# Altium schematic sheet Sheet1.SchDoc
size A4; SheetNumber: 1; SheetTotal: 1
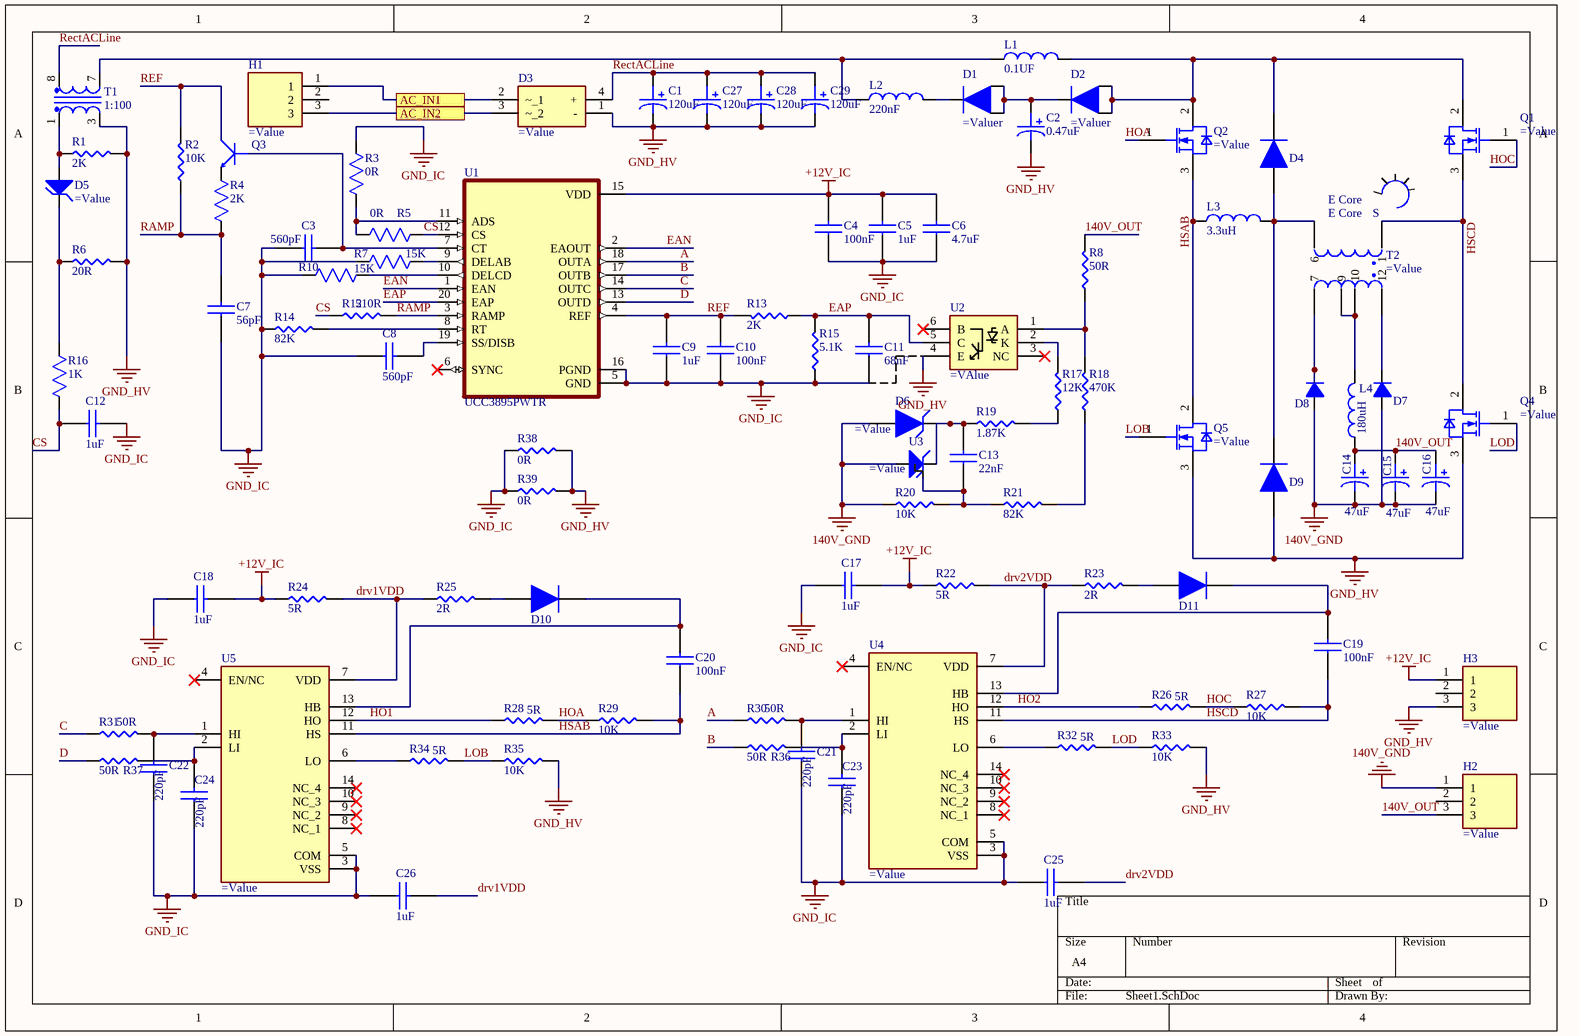
[diagram p0: Sheet1.SchDoc]

## Parts
(Parts that share a designator on the sheet are numbered #1, #2 ... from top to bottom, then left to right.)
?#1  (no value)
?#2  (no value)
C1  120uF  [18AL_CAP]
C2  0.47uF  [860021373001_PCB]
C3  560pF  [CAP_0805]
C4  100nF  [CAP_0805]
C5  1uF  [CAP_0805]
C6  4.7uF  [CAP_0805]
C7  56pF  [CAP_0805]
C8  560pF  [CAP_0805]
C9  1uF  [CAP_0805]
C10  100nF  [CAP_0805]
C11  68nF  [CAP_0805]
C12  1uF  [CAP_0805]
C13  22nF  [CAP_0805]
C14  47uF  [CAP200V47uF]
C15  47uF  [CAP200V47uF]
C16  47uF  [CAP200V47uF]
C17  1uF  [CAP_0805]
C18  1uF  [CAP_0805]
C19  100nF  [CAP_0805]
C20  100nF  [CAP_0805]
C21  220pF  [CAP_0805]
C22  220pF  [CAP_0805]
C23  220pF  [CAP_0805]
C24  220pF  [CAP_0805]
C25  1uF  [CAP_0805]
C26  1uF  [CAP_0805]
C27  120uF  [18AL_CAP]
C28  120uF  [18AL_CAP]
C29  120uF  [18AL_CAP]
D1  (no value)  [DPAK(TO-252-2)]
D2  (no value)  [DPAK(TO-252-2)]
D3  (no value)  [4-SIP]
D4  (no value)  [DO-214AB(SMC)]
D5  (no value)  [SOD123]
D6  (no value)  [DO_214AA]
D7  (no value)  [DPAK(TO-252-2)]
D8  (no value)  [DPAK(TO-252-2)]
D9  (no value)  [DO-214AB(SMC)]
D10  (no value)  [DO-214AB(SMC)]
D11  (no value)  [DO-214AB(SMC)]
H1  (no value)  [3 x 5.08 POS]
H2  (no value)  [3 x 5.08 POS]
H3  (no value)  [3 x 5.08 POS]
L1  0.1UF  [7.30mm x 6.60mm]
L2  220nF  [7.30mm x 6.60mm]
L3  3.3uH  [14.4MOHM SMD]
L4  180uH  [2300HT-181-V-RC]
Q1  (no value)  [TO220]
Q2  (no value)  [TO220]
Q3  (no value)  [SOT-23-3]
Q4  (no value)  [TO220]
Q5  (no value)  [TO220]
R1  2K  [RES_0805]
R2  10K  [RES_0805]
R3  0R  [RES_0805]
R4  2K  [RES_0805]
R5  0R  [RES_0805]
R6  20R  [RES_0805]
R7  15K  [RES_0805]
R8  50R  [RES_0805]
R10  15K  [RES_0805]
R12  510R  [RES_0805]
R13  2K  [RES_0805]
R14  82K  [RES_0805]
R15  5.1K  [RES_0805]
R16  1K  [RES_0805]
R17  12K  [RES_0805]
R18  470K  [RES_0805]
R19  1.87K  [RES_0603]
R20  10K  [RES_0805]
R21  82K  [RES_0805]
R22  5R  [RES_0805]
R23  2R  [RES_0805]
R24  5R  [RES_0805]
R25  2R  [RES_0805]
R26  5R  [RES_0805]
R27  10K  [RES_0805]
R28  5R  [RES_0805]
R29  10K  [RES_0805]
R30  50R  [RES_0805]
R31  50R  [RES_0805]
R32  5R  [RES_0805]
R33  10K  [RES_0805]
R34  5R  [RES_0805]
R35  10K  [RES_0805]
R36  50R  [RES_0805]
R37  50R  [RES_0805]
R38  0R  [RES_0805]
R39  0R  [RES_0805]
S  (no value)  [Sogutucu60x90]
T1  1:100  [PA1005.100QNLT]
T2  (no value)  [FE0270]
U1  UCC3895PWTR  [20-SOIC]
U2  (no value)  [CNY172SM_FP]
U3  (no value)  [SOT-23-3]
U4  (no value)  [14-SOP]
U5  (no value)  [14-SOP]

## Ports
AC_IN1, AC_IN2

## Nets
140V_GND: C14.2 C15.2 C16.2 D6.A D7.3 D8.3 H2.1 R20.1 U3.2
+12V_IC: C4.2 C5.2 C6.2 C17.2 C18.2 H3.1 R22.1 R24.1 U1.15(VDD)
GND_HV: C1.2 C2.2 C27.2 C28.2 C29.2 D3.1(-) D9.2 H3.3 Q4.3(SOURCE) Q5.3(SOURCE) R1.2 R6.2 R33.2 R35.2 R38.2 R39.2 T1.3 U2.4(E)
GND_IC: C3.1 C4.1 C5.1 C6.1 C7.1 C8.1 C9.1 C10.1 C11.1 C12.2 C17.1 C18.1 C21.1 C22.1 C23.1 C24.1 C25.1 C26.1 R3.2 R7.1 R10.1 R14.1 R15.1 R38.1 R39.1 U1.5(GND) U1.16(PGND) U4.3(VSS) U4.5(COM) U5.3(VSS) U5.5(COM)
140V_OUT: C14.1 C15.1 C16.1 H2.3 L4.1 R8.2
A: R30.1 U1.18(OUTA)
AC_IN1: D3.2(~_1) H1.1 ; port AC_IN1
AC_IN2: D3.3(~_2) H1.3 ; port AC_IN2
B: R36.1 U1.17(OUTB)
C: R31.1 U1.14(OUTC)
CS: C12.1 R5.2 R12.1 R16.1 U1.12(CS)
D: R37.1 U1.13(OUTD)
drv1VDD: C26.2 R24.2 R25.1 U5.7(VDD)
drv2VDD: C25.2 R22.2 R23.1 U4.7(VDD)
EAN: U1.1(EAN) U1.2(EAOUT)
EAP: C11.2 R13.1 R15.2 U1.20(EAP) U2.5(C)
HO1: R28.1 U5.12(HO)
HO2: R26.1 U4.12(HO)
HOA: Q2.1(GATE) R28.2 R29.1
HOC: Q1.1(GATE) R26.2 R27.1
HSAB: C20.1 L3.1 Q2.3(SOURCE) Q5.2(DRAIN) R29.2 U5.11(HS)
HSCD: C19.1 Q1.3(SOURCE) Q4.2(DRAIN) R27.2 T2.1 U4.11(HS)
LOB: Q5.1(GATE) R34.2 R35.1
LOD: Q4.1(GATE) R32.2 R33.1
RAMP: C7.2 R2.1 R4.1 R12.2 U1.3(RAMP)
RectACLine: C1.1 C27.1 C28.1 C29.1 D3.4(+) T1.8
REF: C9.2 C10.2 Q3.3(C) R2.2 R13.2 U1.4(REF)
NetC2_1: C2.1 D1.1 D1.3 D2.2
NetC3_2: C3.2 Q3.1(B) U1.7(CT)
NetC8_2: C8.2 U1.19(SS/DISB)
NetC13_1: C13.1 R20.2 R21.1 U3.1
NetC13_2: C13.2 D6.C R19.1 U3.3
NetC19_2: C19.2 D11.1 U4.13(HB)
NetC20_2: C20.2 D10.1 U5.13(HB)
NetC21_2: C21.2 R30.2 U4.1(HI)
NetC22_2: C22.2 R31.2 U5.1(HI)
NetC23_2: C23.2 R36.2 U4.2(LI)
NetC24_2: C24.2 R37.2 U5.2(LI)
NetD1_2: D1.2 L2.2
NetD2_1: D2.1 D2.3 D4.1 L1.2 Q1.2(DRAIN) Q2.2(DRAIN)
NetD4_2: D4.2 D9.1 L3.2 T2.6
NetD5_1: D5.1 R6.1 R16.2
NetD5_2: D5.2 R1.1 T1.1
NetD7_2: D7.2 T2.12
NetD8_2: D8.2 T2.7
NetD10_2: D10.2 R25.2
NetD11_2: D11.2 R23.2
NetL1_1: L1.1 L2.1 T1.7
NetL4_2: L4.2 T2.9 T2.10
NetQ3_2: Q3.2(E) R4.2
NetR3_1: R3.1 R5.1 U1.11(ADS)
NetR7_2: R7.2 U1.9(DELAB)
NetR8_1: R8.1 R18.2 U2.1(A)
NetR10_2: R10.2 U1.10(DELCD)
NetR14_2: R14.2 U1.8(RT)
NetR17_1: R17.1 R19.2
NetR17_2: R17.2 U2.2(K)
NetR18_1: R18.1 R21.2
NetR32_1: R32.1 U4.6(LO)
NetR34_1: R34.1 U5.6(LO)

Not connected (* = marked no-connect by the designer): H1 2; H2 2; H3 2; U1 6(SYNC)*; U2 3(NC)* 6(B)*; U4 4(EN/NC)* 8(NC_1)* 9(NC_2)* 10(NC_3)* 14(NC_4)*; U5 4(EN/NC)* 8(NC_1)* 9(NC_2)* 10(NC_3)* 14(NC_4)*

## Library data of the parts
?#1 ?#2 = 62: E Core; MANUFACTURER P/N: 7070 42-21-15-0000; MANUFACTURER: Ferrite International; Stoc Code: 62; SUPPLIER 1: Digikey; SUPPLIER PART NUMBER 1: 5885-707042-21-15-0000-ND; ComponentLink1Description: datasheet; ComponentLink1URL: https://tscinternational.com/assets/files/SIZE-ECoreCat.pdf
C1 C27-C29 = 63: 120 µF 400 V Aluminum Electrolytic Capacitors Radial, Can 12000 Hrs @ 105°C; Manufacturer: Nichicon; Manufacturer Part Number: EEV686M035A9HAA; MANUFACTURER P/N: UCY2G121MHD; Impedance: 340mR; Voltage Rating: 35V; Tolerance: 20%; Ripple Current: 196mA; Life (Hours): 2000Hour; Designator by: BERK; Stoc Code: 63; Supplier 1: Digikey; RoHS: Yes; Category: Aluminum Electrolytic Capacitors; Stock 1: 543; Pricing 1: 1=0,54000, 10=0,38000, 50=0,28740, 100=0,25040, 500=0,18546 (USD); Mount: Surface Mount; Case/Package: Radial; Min Operating Temperature: -40°C; Max Operating Temperature: 105°C; Packaging: Tape and Reel; Package Quantity: 1; Voltage Rating (DC): 35V; Termination: SMD/SMT; Series: EEV; Length: 7.7mm; Height - Seated (Max): 0.315inch; RoHS Compliant: Yes; ComponentLink1URL: https://www.nichicon.co.jp/english/series_items/catalog_pdf/e-ucy.pdf; ComponentLink1Description: datasheet; Supplier Part Number 1: 493-5466-ND; Value: 120uF
C2 = 60: 0.47 µF 400 V Aluminum Electrolytic Capacitors Radial, Can 2000 Hrs @ 105°C; Manufacturer: Würth Elektronik; Manufacturer Part Number: EEV686M035A9HAA; MANUFACTURER P/N: 860021373001; Impedance: 340mR; Voltage Rating: 35V; Tolerance: 20%; Ripple Current: 196mA; Life (Hours): 2000Hour; Designator by: BERK; Stoc Code: 60; Supplier 1: Digikey; RoHS: Yes; Category: Aluminum Electrolytic Capacitors; Stock 1: 543; Pricing 1: 1=0,54000, 10=0,38000, 50=0,28740, 100=0,25040, 500=0,18546 (USD); Mount: Surface Mount; Case/Package: Radial; Min Operating Temperature: -40°C; Max Operating Temperature: 105°C; Packaging: Tape and Reel; Package Quantity: 1; Voltage Rating (DC): 35V; Termination: SMD/SMT; Series: EEV; Length: 7.7mm; Height - Seated (Max): 0.315inch; RoHS Compliant: Yes; ComponentLink1URL: https://datasheet.ciiva.com/5365/kem-a4002-eev-535332-5365784.pdf?src-supplier=Mouser; ComponentLink1Description: https://datasheet.ciiva.com/5365/kem-a4002-eev-535332-5365784.pdf?src-supplier=Mouser; Supplier Part Number 1: 732-8879-1-ND; Value: 0.47uF
C3 C8 = 27: Cap.,SMD,0805,NP0,560pF,5%,100V; Manufacturer: Aillen; Manufacturer Part Number: CL21B105KBFNNNE; MANUFACTURER P/N: 0805N561J101AD; Designed by: BERK; Tolerance: 10%; Voltage Rating: 50V; Dielectric: X7R; Stoc Code: 27; Supplier 1: Digikey; RoHS: Yes; Category: Ceramic Capacitors; Stock 1: 958000; Pricing 1: 2000=0,02138, 4000=0,01956 (USD); Mount: Surface Mount; Case/Package: 0805; Case Code (Metric): 2012; Case Code (Imperial): 0805; Min Operating Temperature: -55°C; Max Operating Temperature: 125°C; Packaging: Tape and Reel; Package Quantity: 1; Voltage: 50V; Series: CL; Construction: Flat; Length: 2mm; Width: 0.049inch; Height: 1.25mm; Thickness: 0.053inch; Depth: 1.25mm; Radiation Hardening: No; RoHS Compliant: Yes; ComponentLink1URL: https://datasheet.ciiva.com/25800/cl21b105kbfnnne-25800291.pdf?src-supplier=Digi-Key; ComponentLink1Description: https://datasheet.ciiva.com/25800/cl21b105kbfnnne-25800291.pdf?src-supplier=Digi-Key; ComponentLink2URL: https://datasheet.ciiva.com/16449/cl21b105kbfnnne-16449003.pdf?src-supplier=Future+Electronics; ComponentLink2Description: https://datasheet.ciiva.com/16449/cl21b105kbfnnne-16449003.pdf?src-supplier=Future+Electronics; ComponentLink3URL: https://datasheet.ciiva.com/26838/getdatasheetpartid-354075-26838668.pdf?src-supplier=Verical; ComponentLink3Description: https://datasheet.ciiva.com/26838/getdatasheetpartid-354075-26838668.pdf?src-supplier=Verical; Supplier Part Number 1: 3372-0805N561J101ADTR-ND; Value: 560pF
C4 C10 C19 C20 = 31: Auto. MLCC X7R 100nF 10% 100V 08; Manufacturer: EYang Technology; Manufacturer Part Number: CL21B105KBFNNNE; MANUFACTURER P/N: E0805X7R104K101NTY; Designed by: BERK; Voltage Rating: 50V; Stoc Code: 31; Supplier 1: Digikey; RoHS: Yes; Category: Ceramic Capacitors; Stock 1: 958000; Pricing 1: 2000=0,02138, 4000=0,01956 (USD); Mount: Surface Mount; Case/Package: 0805; Case Code (Metric): 2012; Case Code (Imperial): 0805; Min Operating Temperature: -55°C; Max Operating Temperature: 125°C; Tolerance: 10%; Packaging: Tape and Reel; Package Quantity: 1; Dielectric: X7R; Voltage: 50V; Series: CL; Construction: Flat; Length: 2mm; Width: 0.049inch; Height: 1.25mm; Thickness: 0.053inch; Depth: 1.25mm; Radiation Hardening: No; RoHS Compliant: Yes; ComponentLink1URL: https://datasheet.ciiva.com/25800/cl21b105kbfnnne-25800291.pdf?src-supplier=Digi-Key; ComponentLink1Description: https://datasheet.ciiva.com/25800/cl21b105kbfnnne-25800291.pdf?src-supplier=Digi-Key; ComponentLink2URL: https://datasheet.ciiva.com/16449/cl21b105kbfnnne-16449003.pdf?src-supplier=Future+Electronics; ComponentLink2Description: https://datasheet.ciiva.com/16449/cl21b105kbfnnne-16449003.pdf?src-supplier=Future+Electronics; ComponentLink3URL: https://datasheet.ciiva.com/26838/getdatasheetpartid-354075-26838668.pdf?src-supplier=Verical; ComponentLink3Description: https://datasheet.ciiva.com/26838/getdatasheetpartid-354075-26838668.pdf?src-supplier=Verical; Supplier Part Number 1: 3372-E0805X7R104K101NTYTR-ND; Value: 100nF
C5 C9 C12 C17 C18 C25 C26 = 22: CAP SMD,0805,X7R,1UF,10%,50V; Manufacturer: Aillen; Manufacturer Part Number: CL21B105KBFNNNE; MANUFACTURER P/N: 0805B105K500CC; Designed by: BERK; Stoc Code: 22; Supplier 1: Digikey; RoHS: Yes; Category: Ceramic Capacitors; Stock 1: 958000; Pricing 1: 2000=0,02138, 4000=0,01956 (USD); Mount: Surface Mount; Case/Package: 0805; Case Code (Metric): 2012; Case Code (Imperial): 0805; Min Operating Temperature: -55°C; Max Operating Temperature: 125°C; Tolerance: 10%; Packaging: Tape and Reel; Package Quantity: 1; Voltage Rating: 50V; Dielectric: X7R; Voltage: 50V; Series: CL; Construction: Flat; Length: 2mm; Width: 0.049inch; Height: 1.25mm; Thickness: 0.053inch; Depth: 1.25mm; Radiation Hardening: No; RoHS Compliant: Yes; ComponentLink1URL: https://datasheet.ciiva.com/25800/cl21b105kbfnnne-25800291.pdf?src-supplier=Digi-Key; ComponentLink1Description: https://datasheet.ciiva.com/25800/cl21b105kbfnnne-25800291.pdf?src-supplier=Digi-Key; ComponentLink2URL: https://datasheet.ciiva.com/16449/cl21b105kbfnnne-16449003.pdf?src-supplier=Future+Electronics; ComponentLink2Description: https://datasheet.ciiva.com/16449/cl21b105kbfnnne-16449003.pdf?src-supplier=Future+Electronics; ComponentLink3URL: https://datasheet.ciiva.com/26838/getdatasheetpartid-354075-26838668.pdf?src-supplier=Verical; ComponentLink3Description: https://datasheet.ciiva.com/26838/getdatasheetpartid-354075-26838668.pdf?src-supplier=Verical; Supplier Part Number 1: 3372-0805B105K500CCTR-ND; Value: 1uF
C6 = 32: CAP,SMD,0805,X7R,4.7UF,10%,25V; Manufacturer: NextGen Components; Manufacturer Part Number: CL21B105KBFNNNE; MANUFACTURER P/N: 0805B475K250CC; Designed by: BERK; Voltage Rating: 50V; Stoc Code: 32; Supplier 1: Digikey; RoHS: Yes; Category: Ceramic Capacitors; Stock 1: 958000; Pricing 1: 2000=0,02138, 4000=0,01956 (USD); Mount: Surface Mount; Case/Package: 0805; Case Code (Metric): 2012; Case Code (Imperial): 0805; Min Operating Temperature: -55°C; Max Operating Temperature: 125°C; Tolerance: 10%; Packaging: Tape and Reel; Package Quantity: 1; Dielectric: X7R; Voltage: 50V; Series: CL; Construction: Flat; Length: 2mm; Width: 0.049inch; Height: 1.25mm; Thickness: 0.053inch; Depth: 1.25mm; Radiation Hardening: No; RoHS Compliant: Yes; ComponentLink1URL: https://datasheet.ciiva.com/25800/cl21b105kbfnnne-25800291.pdf?src-supplier=Digi-Key; ComponentLink1Description: https://datasheet.ciiva.com/25800/cl21b105kbfnnne-25800291.pdf?src-supplier=Digi-Key; ComponentLink2URL: https://datasheet.ciiva.com/16449/cl21b105kbfnnne-16449003.pdf?src-supplier=Future+Electronics; ComponentLink2Description: https://datasheet.ciiva.com/16449/cl21b105kbfnnne-16449003.pdf?src-supplier=Future+Electronics; ComponentLink3URL: https://datasheet.ciiva.com/26838/getdatasheetpartid-354075-26838668.pdf?src-supplier=Verical; ComponentLink3Description: https://datasheet.ciiva.com/26838/getdatasheetpartid-354075-26838668.pdf?src-supplier=Verical; Supplier Part Number 1: 3372-0805B475K250CCTR-ND; Value: 4.7uF
C7 = 26: CAP,SMD,0805,NP0,56PF,5%,50V; Manufacturer: NextGen Components; Manufacturer Part Number: CL21B105KBFNNNE; MANUFACTURER P/N: 0805N560J500AD; Designed by: BERK; Tolerance: 10%; Dielectric: X7R; Stoc Code: 26; Supplier 1: Digikey; RoHS: Yes; Category: Ceramic Capacitors; Stock 1: 958000; Pricing 1: 2000=0,02138, 4000=0,01956 (USD); Mount: Surface Mount; Case/Package: 0805; Case Code (Metric): 2012; Case Code (Imperial): 0805; Min Operating Temperature: -55°C; Max Operating Temperature: 125°C; Packaging: Tape and Reel; Package Quantity: 1; Voltage Rating: 50V; Voltage: 50V; Series: CL; Construction: Flat; Length: 2mm; Width: 0.049inch; Height: 1.25mm; Thickness: 0.053inch; Depth: 1.25mm; Radiation Hardening: No; RoHS Compliant: Yes; ComponentLink1URL: https://datasheet.ciiva.com/25800/cl21b105kbfnnne-25800291.pdf?src-supplier=Digi-Key; ComponentLink1Description: https://datasheet.ciiva.com/25800/cl21b105kbfnnne-25800291.pdf?src-supplier=Digi-Key; ComponentLink2URL: https://datasheet.ciiva.com/16449/cl21b105kbfnnne-16449003.pdf?src-supplier=Future+Electronics; ComponentLink2Description: https://datasheet.ciiva.com/16449/cl21b105kbfnnne-16449003.pdf?src-supplier=Future+Electronics; ComponentLink3URL: https://datasheet.ciiva.com/26838/getdatasheetpartid-354075-26838668.pdf?src-supplier=Verical; ComponentLink3Description: https://datasheet.ciiva.com/26838/getdatasheetpartid-354075-26838668.pdf?src-supplier=Verical; Supplier Part Number 1: 3372-0805N560J500ADTR-ND; Value: 56pF
C11 = 34: CAP CER 0805 68NF 50V X7R 10%; Manufacturer: KEMET; Manufacturer Part Number: CL21B105KBFNNNE; MANUFACTURER P/N: C0805C683K5RECAUTO; Designed by: BERK; Stoc Code: 34; Supplier 1: Digikey; RoHS: Yes; Category: Ceramic Capacitors; Stock 1: 958000; Pricing 1: 2000=0,02138, 4000=0,01956 (USD); Mount: Surface Mount; Case/Package: 0805; Case Code (Metric): 2012; Case Code (Imperial): 0805; Min Operating Temperature: -55°C; Max Operating Temperature: 125°C; Tolerance: 10%; Packaging: Tape and Reel; Package Quantity: 1; Voltage Rating: 50V; Dielectric: X7R; Voltage: 50V; Series: CL; Construction: Flat; Length: 2mm; Width: 0.049inch; Height: 1.25mm; Thickness: 0.053inch; Depth: 1.25mm; Radiation Hardening: No; RoHS Compliant: Yes; ComponentLink1URL: https://datasheet.ciiva.com/25800/cl21b105kbfnnne-25800291.pdf?src-supplier=Digi-Key; ComponentLink1Description: https://datasheet.ciiva.com/25800/cl21b105kbfnnne-25800291.pdf?src-supplier=Digi-Key; ComponentLink2URL: https://datasheet.ciiva.com/16449/cl21b105kbfnnne-16449003.pdf?src-supplier=Future+Electronics; ComponentLink2Description: https://datasheet.ciiva.com/16449/cl21b105kbfnnne-16449003.pdf?src-supplier=Future+Electronics; ComponentLink3URL: https://datasheet.ciiva.com/26838/getdatasheetpartid-354075-26838668.pdf?src-supplier=Verical; ComponentLink3Description: https://datasheet.ciiva.com/26838/getdatasheetpartid-354075-26838668.pdf?src-supplier=Verical; Supplier Part Number 1: 399-C0805C683K5RECAUTOTR-ND; Value: 68nF
C13 = 40: CAP CER 0805 22NF 200V X7R 10%; Manufacturer: KEMET; Manufacturer Part Number: CL21B105KBFNNNE; MANUFACTURER P/N: C0805C223K2RECAUTO; Designed by: BERK; Voltage Rating: 50V; Stoc Code: 40; Supplier 1: Digikey; RoHS: Yes; Category: Ceramic Capacitors; Stock 1: 958000; Pricing 1: 2000=0,02138, 4000=0,01956 (USD); Mount: Surface Mount; Case/Package: 0805; Case Code (Metric): 2012; Case Code (Imperial): 0805; Min Operating Temperature: -55°C; Max Operating Temperature: 125°C; Tolerance: 10%; Packaging: Tape and Reel; Package Quantity: 1; Dielectric: X7R; Voltage: 50V; Series: CL; Construction: Flat; Length: 2mm; Width: 0.049inch; Height: 1.25mm; Thickness: 0.053inch; Depth: 1.25mm; Radiation Hardening: No; RoHS Compliant: Yes; ComponentLink1URL: https://datasheet.ciiva.com/25800/cl21b105kbfnnne-25800291.pdf?src-supplier=Digi-Key; ComponentLink1Description: https://datasheet.ciiva.com/25800/cl21b105kbfnnne-25800291.pdf?src-supplier=Digi-Key; ComponentLink2URL: https://datasheet.ciiva.com/16449/cl21b105kbfnnne-16449003.pdf?src-supplier=Future+Electronics; ComponentLink2Description: https://datasheet.ciiva.com/16449/cl21b105kbfnnne-16449003.pdf?src-supplier=Future+Electronics; ComponentLink3URL: https://datasheet.ciiva.com/26838/getdatasheetpartid-354075-26838668.pdf?src-supplier=Verical; ComponentLink3Description: https://datasheet.ciiva.com/26838/getdatasheetpartid-354075-26838668.pdf?src-supplier=Verical; Supplier Part Number 1: 399-C0805C223K2RECAUTOTR-ND; Value: 22nF
C14-C16 = 54: CAP ALUM 47UF 20% 200V RADIAL TH; Manufacturer: KYOCERA AVX; Manufacturer Part Number: EEV686M035A9HAA; MANUFACTURER P/N: REH1218470M200K; Impedance: 340mR; Voltage Rating: 35V; Ripple Current: 196mA; Life (Hours): 2000Hour; Designator by: BERK; Stoc Code: 54; Supplier 1: Digikey; RoHS: Yes; Category: Aluminum Electrolytic Capacitors; Stock 1: 543; Pricing 1: 1=0,54000, 10=0,38000, 50=0,28740, 100=0,25040, 500=0,18546 (USD); Mount: Surface Mount; Case/Package: Radial; Min Operating Temperature: -40°C; Max Operating Temperature: 105°C; Packaging: Tape and Reel; Package Quantity: 1; Tolerance: 20%; Voltage Rating (DC): 35V; Termination: SMD/SMT; Series: EEV; Length: 7.7mm; Height - Seated (Max): 0.315inch; RoHS Compliant: Yes; ComponentLink1URL: https://datasheets.kyocera-avx.com/reh-series.pdf; ComponentLink1Description: datasheet; Supplier Part Number 1: 478-REH1218470M200KCT-ND; Value: 47uF
C21-C24 = 44: CAP CER 220PF 250V C0G/NP0 0805; Manufacturer: KYOCERA AVX; Manufacturer Part Number: CL21B105KBFNNNE; MANUFACTURER P/N: 600F221JT250XT4K; Designed by: BERK; Tolerance: 10%; Voltage Rating: 50V; Dielectric: X7R; Stoc Code: 44; Supplier 1: Digikey; RoHS: Yes; Category: Ceramic Capacitors; Stock 1: 958000; Pricing 1: 2000=0,02138, 4000=0,01956 (USD); Mount: Surface Mount; Case/Package: 0805; Case Code (Metric): 2012; Case Code (Imperial): 0805; Min Operating Temperature: -55°C; Max Operating Temperature: 125°C; Packaging: Tape and Reel; Package Quantity: 1; Voltage: 50V; Series: CL; Construction: Flat; Length: 2mm; Width: 0.049inch; Height: 1.25mm; Thickness: 0.053inch; Depth: 1.25mm; Radiation Hardening: No; RoHS Compliant: Yes; ComponentLink1URL: https://datasheet.ciiva.com/25800/cl21b105kbfnnne-25800291.pdf?src-supplier=Digi-Key; ComponentLink1Description: https://datasheet.ciiva.com/25800/cl21b105kbfnnne-25800291.pdf?src-supplier=Digi-Key; ComponentLink2URL: https://datasheet.ciiva.com/16449/cl21b105kbfnnne-16449003.pdf?src-supplier=Future+Electronics; ComponentLink2Description: https://datasheet.ciiva.com/16449/cl21b105kbfnnne-16449003.pdf?src-supplier=Future+Electronics; ComponentLink3URL: https://datasheet.ciiva.com/26838/getdatasheetpartid-354075-26838668.pdf?src-supplier=Verical; ComponentLink3Description: https://datasheet.ciiva.com/26838/getdatasheetpartid-354075-26838668.pdf?src-supplier=Verical; Supplier Part Number 1: 478-600F221JT250XT4KTR-ND; Value: 220pF
D1 D2 = 57: DIODE STANDARD 600V 20A DPAK; MANUFACTURER P/N: SDURD2060; MANUFACTURER: SMC Diode Solutions; Stoc Code: 57; SUPPLIER 1: Digikey; SUPPLIER PART NUMBER 1: 1655-SDURD2060TR-ND; ComponentLink1Description: datasheet; ComponentLink1URL: https://www.smc-diodes.com/propdf/SDURD2060%20N1569%20REV.A.pdf
D3 = 55: Bridge Rectifier Single Phase Standard 1 kV Through Hole GBU; MANUFACTURER P/N: GBUA10M-BP; MANUFACTURER: MCC (Micro Commercial Components); Stoc Code: 55; SUPPLIER 1: Digikey; SUPPLIER PART NUMBER 1: 353-GBUA10M-BP-ND; ComponentLink1Description: datasheet; ComponentLink1URL: https://www.mccsemi.com/pdf/Products/GBUA10M(JC).pdf
D4 D9-D11 = 46: Diode 600 V 3A Surface Mount SMC; Manufacturer: onsemi; MANUFACTURER P/N: MURS360T3G; Designed by: Yunus; Forward Current: 150mA; Reverse Recovery Time: 4ns; Max Repetitive Reverse Voltage (Vrrm): 75V; Power Dissipation: 200mW; Max Reverse Current: 5uA; Forward Voltage: 1V; Max Forward Surge Current (Ifsm): 2A; Element Configuration: Single; Stoc Code: 46; Supplier 1: Digikey; Category: Rectifier Diodes; Stock 1: 79118; Pricing 1: 1=0,17000, 10=0,12100, 100=0,06530, 500=0,05128, 1000=0,03562 (USD); Mount: Surface Mount; Number of Pins: 2; Contact Plating: Tin,Matte; Weight: 0.0276g; Min Operating Temperature: -55°C; Max Operating Temperature: 150°C; Packaging: Tape and Reel; Package Quantity: 1; Recovery Time: 4ns; Average Rectified Current: 150mA; Reverse Voltage: 75V; Max Reverse Voltage (DC): 75V; Series: -; Length: 1.8mm; Width: 1.35mm; Height: 1mm; Radiation Hardening: No; REACH SVHC: No SVHC; Lead Free: Lead Free; RoHS Compliant: Yes; ComponentLink1Description: https://datasheet.ciiva.com/25968/1n914bws-25968945.pdf?src-supplier=Avnet+Europe; ComponentLink2Description: https://datasheet.ciiva.com/30479/0900766b810e1cd3-30479206.pdf?src-supplier=RSComponents; ComponentLink3Description: https://datasheet.ciiva.com/910/1n4148ws-910381.pdf?src-supplier=Digi-Key; ComponentLink4Description: https://datasheet.ciiva.com/15208/getdatasheetpartid-127819-15208358.pdf?src-supplier=Verical; ComponentLink5Description: https://datasheet.ciiva.com/8300/1n914bws-8300360.pdf?src-supplier=Avnet; ComponentLink6URL: https://datasheet.ciiva.com/910/1n4148ws-910380.pdf?src-supplier=Digi-Key; ComponentLink6Description: https://datasheet.ciiva.com/910/1n4148ws-910380.pdf?src-supplier=Digi-Key; ComponentLink7URL: https://datasheet.ciiva.com/910/1n4148ws-910382.pdf?src-supplier=Digi-Key; ComponentLink7Description: https://datasheet.ciiva.com/910/1n4148ws-910382.pdf?src-supplier=Digi-Key; Supplier Part Number 1: MURS360T3GOSTR-ND
D5 = 18: Diode 30 V 200mA Surface Mount SOD-123; MANUFACTURER P/N: BAT54T1; MANUFACTURER: onsemi; Stoc Code: 18; SUPPLIER 1: Digikey; SUPPLIER PART NUMBER 1: BAT54T1OSTR-ND; ComponentLink1Description: datasheet; ComponentLink1URL: https://www.onsemi.com/pdf/datasheet/bat54t1-d.pdf
D6 = 38: DIODE ZENER 140V 5W DO214AA; Manufacturer: MCC (Micro Commercial Components); Manufacturer Part Number: 9BT3G; MANUFACTURER P/N: SMBJ5382B-TP; Material: Plastic; Max Power Dissipation: 3W; Tolerance: 5%; Max Reverse Leakage Current: 5uA; Impedance: 2R; Zener Voltage: 5.6V; Element Configuration: Single; Forward Voltage: 1.5V; Power Dissipation: 550mW; Zener Current: 267mA; Test Current: 66.9mA; Breakdown Voltage: 5.88V; ESD Protection: Yes; Stoc Code: 38; Supplier 1: Digikey; Category: Zener Diodes; Pricing 1: 1=0,45000, 10=0,31900, 100=0,16110, 500=0,14274, 1000=0,11109 (USD); Case/Package: SMB; Number of Pins: 2; Contact Plating: Tin,Matte; Min Operating Temperature: -65°C; Max Operating Temperature: 150°C; Package Quantity: 1; Packaging: Tape and Reel; Voltage Tolerance: 5%; Voltage Rating (DC): 5.6V; Power Rating: 3W; Length: 4.32mm; Width: 3.56mm; Height: 2.13mm; Radiation Hardening: No; Lead Free: Lead Free; Halogen Free: Halogen Free; REACH SVHC: No SVHC; ComponentLink1URL: https://www.mccsemi.com/pdf/Products/SMBJ5338B-SMBJ5388B(SMB).pdf; ComponentLink1Description: datasheet; ComponentLink2Description: https://datasheet.ciiva.com/1182/1smb5913bt3-d-1182657.pdf?src-supplier=Element14; ComponentLink3Description: https://datasheet.ciiva.com/1182/1smb5913bt3-d-1182658.pdf?src-supplier=Element14; ComponentLink4Description: https://datasheet.ciiva.com/895/1smb5913bt3-d-895203.pdf?src-supplier=Digi-Key; ComponentLink5Description: https://datasheet.ciiva.com/895/1smb5913bt3-d-895204.pdf?src-supplier=Digi-Key; ComponentLink6URL: https://datasheet.ciiva.com/895/1smb5913bt3-d-895205.pdf?src-supplier=Digi-Key; ComponentLink6Description: https://datasheet.ciiva.com/895/1smb5913bt3-d-895205.pdf?src-supplier=Digi-Key; ComponentLink7URL: https://datasheet.ciiva.com/15198/getdatasheetpartid-311040-15198695.pdf?src-supplier=Verical; ComponentLink7Description: https://datasheet.ciiva.com/15198/getdatasheetpartid-311040-15198695.pdf?src-supplier=Verical; ComponentLink8URL: https://datasheet.ciiva.com/16311/1smb5913bt3-d-16311847.pdf?src-supplier=Future+Electronics; ComponentLink8Description: https://datasheet.ciiva.com/16311/1smb5913bt3-d-16311847.pdf?src-supplier=Future+Electronics; ComponentLink9URL: https://datasheet.ciiva.com/16472/1smb5913bt3-d-16472779.pdf?src-supplier=Avnet+Asia; ComponentLink9Description: https://datasheet.ciiva.com/16472/1smb5913bt3-d-16472779.pdf?src-supplier=Avnet+Asia; Max Reverse Current: 5uA; Supplier Part Number 1: SMBJ5382B-TPMSTR-ND
D7 D8 = 51: DIODE SCHOTTKY 1200V 5A DPAK; MANUFACTURER P/N: S4D05120E1; MANUFACTURER: SMC Diode Solutions; Stoc Code: 51; SUPPLIER 1: Digikey; SUPPLIER PART NUMBER 1: 1655-S4D05120E1TR-ND; ComponentLink1Description: datasheet; ComponentLink1URL: https://www.smc-diodes.com/propdf/S4D05120E1%20N2429%20REV.B.pdf
H1-H3 = 15: TERM BLOCK HDR 3POS 5.08MM; MANUFACTURER P/N: TBP01R1-508-03BE; MANUFACTURER: Same Sky (Formerly CUI Devices); Stoc Code: 15; SUPPLIER 1: Digikey; SUPPLIER PART NUMBER 1: 102-6407-ND; ComponentLink1Description: datasheet; ComponentLink1URL: https://www.cuidevices.com/product/resource/tbp01r1-508.pdf
L1 = 59: 100 nH Shielded Wirewound Inductor 37.5 A 1.7mOhm Max Nonstandard; MANUFACTURER P/N: SRP7028CC-R10Y; MANUFACTURER: Bourns Inc.; Stoc Code: 59; Value: 0.1UF; SUPPLIER 1: Digikey; SUPPLIER PART NUMBER 1: SRP7028CC-R10Y; ComponentLink1Description: datasheet; ComponentLink1URL: https://www.bourns.com/docs/Product-Datasheets/SRP7028CC.pdf
L2 = 58: 220 nH Shielded Molded Inductor 23 A 2.8mOhm Max Nonstandard; MANUFACTURER P/N: BMRA00060630R22MA1; MANUFACTURER: Pulse Electronics; Stoc Code: 58; Value: 220nF; SUPPLIER 1: Digikey; SUPPLIER PART NUMBER 1: 553-BMRA00060630R22MA1TR-ND; ComponentLink1Description: datasheet; ComponentLink1URL: https://productfinder.pulseelectronics.com/api/open/part-attachments/datasheet/BMRA00060630R22MA1
L3 = 50: FIXED IND 3.3UH 10A 14.4MOHM SMD; MANUFACTURER P/N: IHLP4040DZER3R3M01; MANUFACTURER: Vishay Dale; Stoc Code: 50; Value: 3.3uH; SUPPLIER 1: Digikey; SUPPLIER PART NUMBER 1: 541-1298-2-ND; ComponentLink1Description: datasheet; ComponentLink1URL: https://www.vishay.com/docs/34193/ihlp-4040dz-01.pdf
L4 = 52: 180 µH Shielded Toroidal Inductor 7.2 A 55mOhm Max Radial, Vertical (Open); MANUFACTURER: Bourns Inc.; Stoc Code: 52; Value: 180uH; MANUFACTURER P/N: 2300HT-181-V-RC; SUPPLIER 1: Digikey; SUPPLIER PART NUMBER 1: 2300HT-181-V-RC-ND; ComponentLink1Description: datasheet; ComponentLink1URL: https://www.bourns.com/docs/Product-Datasheets/2300ht_series.pdf
Q1 Q2 Q4 Q5 = 49: N-Channel 650 V 25A (Tc) 32W (Tc) Through Hole PG-TO220-FP; MANUFACTURER P/N: IPAN60R125PFD7SXKSA1; MANUFACTURER: Infineon Technologies; Stoc Code: 49; SUPPLIER 1: Digikey; SUPPLIER PART NUMBER 1: 448-IPAN60R125PFD7SXKSA1-ND; ComponentLink1Description: datasheet; ComponentLink1URL: https://www.infineon.com/dgdl/Infineon-IPAN60R125PFD7S-DataSheet-v02_01-EN.pdf?fileId=5546d4626df6ee62016e224bf53a667c
Q3 = 24: TRANS NPN 80V 0.5A SOT-23-3; Manufacturer: Diodes Incorporated; MANUFACTURER P/N: MMBTA06-7-F; Designed by: YYunus; Max Power Dissipation: 300mW; Collector Emitter Voltage (VCEO): 40V; Max Collector Current: 200mA; Collector Base Voltage (VCBO): 60V; Frequency: 300MHz; hFE Min: 100; Number of Elements: 1; Emitter Base Voltage (VEBO): 6V; Collector Emitter Saturation Voltage: 300mV; Power Dissipation: 350mW; Element Configuration: Single; Stoc Code: 24; Supplier 1: Digikey; Category: BJTs; Stock 1: 2393281; Pricing 1: 1=0,12000, 10=0,08600, 25=0,08280, 100=0,04660, 500=0,03664, 1000=0,02544 (USD); Mount: Surface Mount; Case/Package: SOT-23; Number of Pins: 3; Weight: 0.000282oz; Contact Plating: Tin,Matte; Min Operating Temperature: -55°C; Max Operating Temperature: 150°C; Polarity: NPN; Packaging: Tape and Reel; Package Quantity: 3000; Transition Frequency: 300MHz; Collector Emitter Breakdown Voltage: 40V; Max Breakdown Voltage: 40V; Continuous Collector Current: 200mA; Max Frequency: 300MHz; Gain Bandwidth Product: 300MHz; Series: -; Collector-emitter Voltage-Max: 300mV; Voltage Rating (DC): 40V; Length: 3.05mm; Width: 1.4mm; Height: 1mm; Radiation Hardening: No; REACH SVHC: No SVHC; Lead Free: Lead Free; RoHS Compliant: Yes; Supplier Part Number 1: MMBTA06-FDITR-ND; ComponentLink1Description: datasheet; ComponentLink1URL: https://www.diodes.com/assets/Datasheets/MMBTA05_MMBTA06.pdf
R1 R4 R13 = 25: RES SMD 2K OHM 0.1% 1/8W 0805; MANUFACTURER P/N: ERA-6AEB202V; MANUFACTURER: Panasonic Electronic Components; Stoc Code: 25; Value: 2K; SUPPLIER 1: Digikey; SUPPLIER PART NUMBER 1: P2.0KDATR-ND
R2 R20 R27 R29 R33 R35 = 23: RES SMD 10K OHM 0.5% 1/10W 0805; MANUFACTURER P/N: RR1220P-103-D; MANUFACTURER: Susumu; Stoc Code: 23; Value: 10K; SUPPLIER 1: Digikey; SUPPLIER PART NUMBER 1: RR12P10.0KDTR-ND
R3 R5 R38 R39 = 28: RES SMD 0 OHM JUMPER 1/8W 0805; MANUFACTURER P/N: ERJ-6GEY0R00V; MANUFACTURER: Panasonic Electronic Components; Stoc Code: 28; Value: 0R; SUPPLIER 1: Digikey; SUPPLIER PART NUMBER 1: P0.0ATR-ND
R6 = 64: RES SMD 20 OHM 0.5% 1/4W 0805; MANUFACTURER P/N: RNCF0805DTE20R0; MANUFACTURER: Stackpole Electronics Inc; Stoc Code: 64; Value: 20R; SUPPLIER 1: Digikey; SUPPLIER PART NUMBER 1: 738-RNCF0805DTE20R0TR-ND
R7 R10 = 19: RES SMD 15K OHM 5% 1/8W 0805; MANUFACTURER P/N: CR10153J; MANUFACTURER: Meritek; Stoc Code: 19; Value: 15K; SUPPLIER 1: Digikey; SUPPLIER PART NUMBER 1: 2997-CR10153JTR-ND
R8 R30 R31 R36 R37 = 20: CRCW0805 50 1% 100 RT1; MANUFACTURER P/N: CRCW080550R0FKTA; MANUFACTURER: Vishay Dale; Stoc Code: 20; Value: 50R; SUPPLIER 1: Digikey; SUPPLIER PART NUMBER 1: 541-CRCW080550R0FKTATR-ND
R12 = 29: RES 510 OHM 5% 1/8W 0805; MANUFACTURER P/N: RMCF0805JT510R; MANUFACTURER: Stackpole Electronics Inc; Stoc Code: 29; Value: 510R; SUPPLIER 1: Digikey; SUPPLIER PART NUMBER 1: RMCF0805JT510RTR-ND
R14 R21 = 30: RES 82K OHM 1% 1/4W 0805; MANUFACTURER P/N: RK73H2ATTD8202F; MANUFACTURER: KOA Speer Electronics, Inc.; Stoc Code: 30; Value: 82K; SUPPLIER 1: Digikey; SUPPLIER PART NUMBER 1: 2019-RK73H2ATTD8202FTR-ND
R15 = 33: RES 5.1K OHM 5% 1/8W 0805; MANUFACTURER: YAGEO; Stoc Code: 33; Value: 5.1K; MANUFACTURER P/N: RES 5.1K OHM 5% 1/8W 0805; SUPPLIER 1: Digikey; SUPPLIER PART NUMBER 1: 311-5.1KARTR-ND
R16 = 21: RES SMD 1K OHM 0.5% 1/10W 0805; MANUFACTURER P/N: RR1220P-102-D; MANUFACTURER: Susumu; Stoc Code: 21; Value: 1K; SUPPLIER 1: Digikey; SUPPLIER PART NUMBER 1: RR12P1.0KDTR-ND
R17 = 36: RES 12K OHM 5% 1/8W 0805; MANUFACTURER P/N: RMCF0805JT12K0; MANUFACTURER: Stackpole Electronics Inc; Stoc Code: 36; Value: 12K; SUPPLIER 1: Digikey; SUPPLIER PART NUMBER 1: 738-RMCF0805JT12K0TR-ND
R18 = 39: RES 470K OHM 1% 1/8W 0805; MANUFACTURER P/N: RC0805FR-07470KL; MANUFACTURER: YAGEO; Stoc Code: 39; Value: 470K; SUPPLIER 1: Digikey; SUPPLIER PART NUMBER 1: 311-470KCRTR-ND
R19 = 37: RES SMD 1.87K OHM 1% 1/20W 0201; MANUFACTURER P/N: ERJ-1GNF1871C; MANUFACTURER: Panasonic Electronic Components; Stoc Code: 37; Value: 1.87K; SUPPLIER 1: Digikey; SUPPLIER PART NUMBER 1: P122796TR-ND
R22 R24 R26 R28 R32 R34 = 43: RES SMD 5 OHM 1% 1/5W 0805; MANUFACTURER P/N: Y40145R00000F9W; MANUFACTURER: VPG Foil Resistors; Stoc Code: 43; Value: 5R; SUPPLIER 1: Digikey; SUPPLIER PART NUMBER 1: 804-1162-ND
R23 R25 = 45: RES 2 OHM 1% 1/8W 0805; MANUFACTURER P/N: RC0805FR-072RL; MANUFACTURER: YAGEO; Stoc Code: 45; Value: 2R; SUPPLIER 1: Digikey; SUPPLIER PART NUMBER 1: 311-2.00CRTR-ND
S = 61: 981AS90 AL.SOĞUTUCU; MANUFACTURER: ARMA; Stoc Code: 61; MANUFACTURER P/N: 981AS90 AL.SOĞUTUCU; SUPPLIER 1: Özdisan; SUPPLIER PART NUMBER 1: 981AS90 AL.SOĞUTUCU
T1 = 17: CURR SENSE XFMR 1:100 20A SMD; MANUFACTURER: Pulse Electronics; Stoc Code: 17; Value: 1:100; MANUFACTURER P/N: PA1005.100QNLT; SUPPLIER 1: Digikey; SUPPLIER PART NUMBER 1: 553-PA1005.100QNLTTR-ND; ComponentLink1Description: datasheet; ComponentLink1URL: https://productfinder.pulseelectronics.com/api/open/part-attachments/datasheet/PA1005.100QNLT
T2 = 53: BOBBIN COIL FORMER E 55X28X21; MANUFACTURER P/N: FE0270FGNNAT0001; MANUFACTURER: Miles Platts Ltd; Stoc Code: 53; SUPPLIER 1: Digikey; SUPPLIER PART NUMBER 1: 5443-FE0270FGNNAT0001-ND; ComponentLink1Description: datasheet; ComponentLink1URL: https://milesplatts.co.uk/Content/Downloads/UPDATED%20Datasheets/FE0270.pdf
U1 = 16: IC OFFLINE SW FULL-BRDG 20SOIC; MANUFACTURER P/N: UCC3895DWTR; MANUFACTURER: Texas Instruments; Stoc Code: 16; Value: UCC3895PWTR; SUPPLIER 1: Digikey; SUPPLIER PART NUMBER 1: 296-27167-2-ND; ComponentLink1Description: datasheet; ComponentLink1URL: https://www.ti.com/general/docs/suppproductinfo.tsp?distId=10&gotoUrl=https%3A%2F%2Fwww.ti.com%2Flit%2Fgpn%2Fucc1895
U2 = 35: OPTOISO 4.17KV TRANS W/BASE 6SMD; MANUFACTURER P/N: CNY172SM; MANUFACTURER: onsemi; Stoc Code: 35; SUPPLIER 1: Digikey; SUPPLIER PART NUMBER 1: CNY172SM-ND; ComponentLink1Description: datasheet; ComponentLink1URL: https://www.onsemi.com/pdf/datasheet/cny17f4m-d.pdf
U3 = 41: IC VREF SHUNT ADJ 1% SOT23-3; MANUFACTURER P/N: TL431AIDBZR; MANUFACTURER: Texas Instruments; Stoc Code: 41; SUPPLIER 1: Digikey; SUPPLIER PART NUMBER 1: 296-17329-2-ND
U4 U5 = 42: Half-Bridge Gate Driver IC Non-Inverting 14-SOP; MANUFACTURER: UMW; Stoc Code: 42; MANUFACTURER P/N: UCC27714DR; SUPPLIER 1: Digikey; SUPPLIER PART NUMBER 1: 4518-UCC27714DRTR-ND; ComponentLink1Description: datasheet; ComponentLink1URL: https://www.umw-ic.com/static/pdf/97fabd9c8eb2de24966959d8d4a51e75.pdf